# Altium schematic sheet Sheet2.SchDoc
size A4
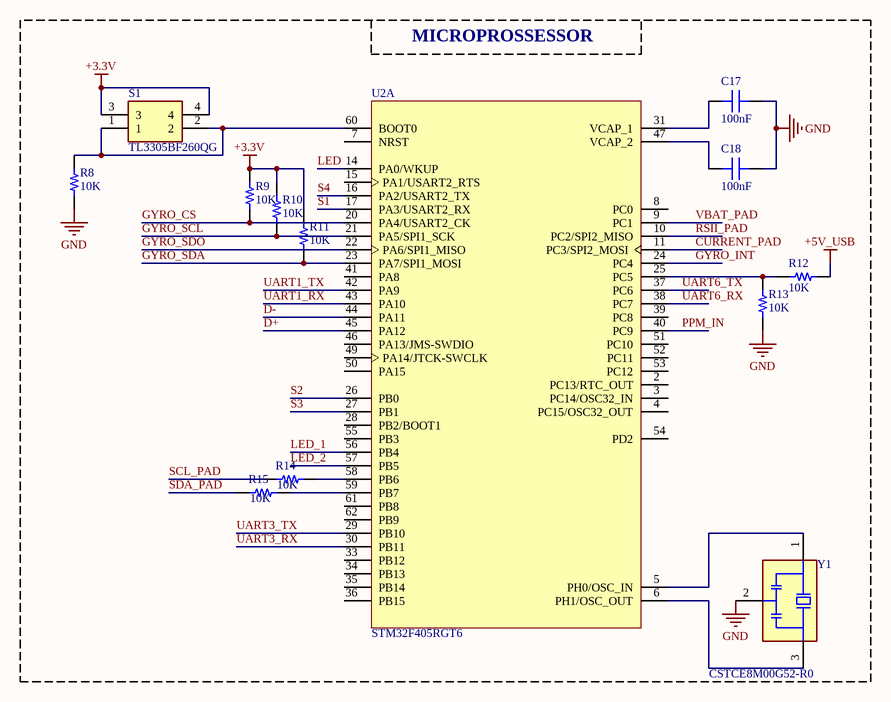
[diagram p0: Sheet2.SchDoc]

## Parts
C17  100nF  [CAP-0603]
C18  100nF  [CAP-0603]
R8  10K  [RES-0603]
R9  10K  [RES-0603]
R10  10K  [RES-0603]
R11  10K  [RES-0603]
R12  10K  [RES-0603]
R13  10K  [RES-0603]
R14  10K  [RES-0603]
R15  10K  [RES-0603]
S1  TL3305BF260QG  [TL3305BF260QG]
U2  STM32F405RGT6  [STMicroelectronics_LQFP64-5W_MFG]  (part A of 2)
Y1  CSTCE8M00G52-R0  [OSC_CSTCE8M00G52-R0]

## Blocks framed on the sheet
MICROPROSSESSOR: C17 C18 R8-R15 S1 U2 Y1

## Nets
+3.3V: R9.2 R10.2 R11.2 S1.3 S1.4
+5V_USB: R12.2
GND: C17.1 C18.1 R8.1 R13.1 Y1.2(GND)
CURRENT_PAD: U2.11(PC3/SPI2_MOSI)
D+: U2.45(PA12)
D-: U2.44(PA11)
GYRO_CS: R9.1 U2.20(PA4/USART2_CK)
GYRO_INT: U2.24(PC4)
GYRO_SCL: R10.1 U2.21(PA5/SPI1_SCK)
GYRO_SDA: R11.1 U2.23(PA7/SPI1_MOSI)
GYRO_SDO: U2.22(PA6/SPI1_MISO)
LED: U2.14(PA0/WKUP)
LED_1: U2.56(PB4)
LED_2: U2.57(PB5)
PPM_IN: U2.40(PC9)
RSII_PAD: U2.10(PC2/SPI2_MISO)
S1: U2.17(PA3/USART2_RX)
S2: U2.26(PB0)
S3: U2.27(PB1)
S4: U2.16(PA2/USART2_TX)
SCL_PAD: R14.1
SDA_PAD: R15.1
UART1_RX: U2.43(PA10)
UART1_TX: U2.42(PA9)
UART3_RX: U2.30(PB11)
UART3_TX: U2.29(PB10)
UART6_RX: U2.38(PC7)
UART6_TX: U2.37(PC6)
VBAT_PAD: U2.9(PC1)
NetC17_2: C17.2 U2.31(VCAP_1)
NetC18_2: C18.2 U2.47(VCAP_2)
NetR8_2: R8.2 S1.1 S1.2 U2.60(BOOT0)
NetR12_1: R12.1 R13.2 U2.25(PC5)
NetR14_2: R14.2 U2.58(PB6)
NetR15_2: R15.2 U2.59(PB7)
NetU2_5: U2.5(PH0/OSC_IN) Y1.1(IN)
NetU2_6: U2.6(PH1/OSC_OUT) Y1.3(OUT)

Not connected (* = marked no-connect by the designer): U2 2(PC13/RTC_OUT) 3(PC14/OSC32_IN) 4(PC15/OSC32_OUT) 7(NRST) 8(PC0) 15(PA1/USART2_RTS) 28(PB2/BOOT1) 33(PB12) 34(PB13) 35(PB14) 36(PB15) 39(PC8) 41(PA8) 46(PA13/JMS-SWDIO) 49(PA14/JTCK-SWCLK) 50(PA15) 51(PC10) 52(PC11) 53(PC12) 54(PD2) 55(PB3) 61(PB8) 62(PB9)

## Library data of the parts
C17 C18 = C0603C104K5RAC7411: Cap Ceramic 0.1uF 50V X7R 10% SMD 0603 125°C Paper T/R 100nF; Manufacturer: KEMET; Dissipation Factor: 2.5%; Supplier 1: Digi-Key; Manufacturer Part Number: C0603C104K5RAC7411; RoHS: Yes; Category: Ceramic Capacitors; Stock 1: 3300000; Pricing 1: 15000=0,01540, 30000=0,01463, 75000=0,01309, 105000=0,01059, 150000=0,01024, 375000=0,00963 (USD); Mount: Surface Mount; Case/Package: 0603; Case Code (Metric): 1608; Case Code (Imperial): 0603; Dielectric Material: Ceramic; Min Operating Temperature: -55°C; Max Operating Temperature: 125°C; Tolerance: 10%; Capacitance: 100nF; Dielectric: X7R; Voltage Rating (DC): 50V; Packaging: Tape and Reel; Package Quantity: 15000; Voltage Rating: 50V; Termination: SMD/SMT; Length: 1.6mm; Width: 0.031inch; Height: 0.8mm; Thickness: 0.035inch; Lead Pitch: 0.7mm; Depth: 0.8mm; Radiation Hardening: No; ComponentLink1URL: https://datasheet.ciiva.com/5424/kem-c1002-x7r-smd-5424426.pdf?src-supplier=Mouser; ComponentLink1Description: https://datasheet.ciiva.com/5424/kem-c1002-x7r-smd-5424426.pdf?src-supplier=Mouser; Supplier Part Number 1: 399-7374-2-ND
R8-R15 = RC0603FR-0710KL: 10 kOhms ±1% 0.1W, 1/10W Chip Resistor 0603 (1608 Metric) Moisture Resistant Thick Film; Manufacturer: Yageo; Resistance: 10kR; Temperature Coefficient: 100ppm/°C; Voltage Rating (DC): 50V; Power Rating: 100mW; Voltage Rating: 75V; Supplier 1: Digi-Key; Manufacturer Part Number: RC0603FR-0710KL; RoHS: Yes; Category: Chip SMD Resistors; Stock 1: 28996893; Pricing 1: 1=0,10000, 10=0,02400, 100=0,00970, 1000=0,00436, 2500=0,00378 (USD); Case/Package: 0603; Number of Pins: 2; Case Code (Imperial): 0603; Case Code (Metric): 1608; Weight: 7.1E-05oz; Size Code: 0603; Min Operating Temperature: -55°C; Max Operating Temperature: 155°C; Tolerance: 1%; Resistor Type: Thick Film; Packaging: Tape and Reel; Termination: SMD/SMT; Features: Moisture Resistant; Series: RC; Max Power Dissipation: 100mW; Number of Terminations: 2; Resistance Tolerance: 1%; Construction: Rectangular; Length: 1.6mm; Width: 0.8mm; Height: 0.45mm; Depth: 0.8mm; Lead Pitch: 0.3mm; REACH SVHC: Unknown; Lead Free: Lead Free; Military Standard: Not; RoHS Compliant: Yes; ComponentLink1URL: https://datasheet.ciiva.com/7660/38590-7660789.pdf?src-supplier=Element14; ComponentLink1Description: https://datasheet.ciiva.com/7660/38590-7660789.pdf?src-supplier=Element14; ComponentLink2URL: https://datasheet.ciiva.com/7983/443971-7983596.pdf?src-supplier=Element14; ComponentLink2Description: https://datasheet.ciiva.com/7983/443971-7983596.pdf?src-supplier=Element14; ComponentLink3URL: https://datasheet.ciiva.com/22747/443971-22747519.pdf?src-supplier=Element14; ComponentLink3Description: https://datasheet.ciiva.com/22747/443971-22747519.pdf?src-supplier=Element14; ComponentLink4URL: https://datasheet.ciiva.com/46440/1868787-46440891.pdf?src-supplier=Element14; ComponentLink4Description: https://datasheet.ciiva.com/46440/1868787-46440891.pdf?src-supplier=Element14; ComponentLink5URL: https://datasheet.ciiva.com/7746/1738695-7746239.pdf?src-supplier=Element14; ComponentLink5Description: https://datasheet.ciiva.com/7746/1738695-7746239.pdf?src-supplier=Element14; ComponentLink6URL: https://datasheet.ciiva.com/15189/getdatasheetpartid-409289-15189591.pdf?src-supplier=Verical; ComponentLink6Description: https://datasheet.ciiva.com/15189/getdatasheetpartid-409289-15189591.pdf?src-supplier=Verical; Supplier Part Number 1: 311-10.0KHRCT-ND
S1 = TL3305BF260QG: Switch; Manufacturer_Name: E-Switch; Datasheet Link: https://sten-eswitch-13110800-production.s3.amazonaws.com/system/asset/product_line/data_sheet/213/TL3305.pdf; Height: 5mm; Manufacturer_Part_Number: TL3305BF260QG; Mouser Part Number: 612-TL3305BF260QG; Mouser Price/Stock: https://www.mouser.co.uk/ProductDetail/E-Switch/TL3305BF260QG?qs=UrFqKgNWc7Tq35XCdypyiw%3D%3D
U2 = STM32F405RGT6: ARMÂ® CortexÂ®-M4 STM32F4 Microcontroller IC 32-Bit 168MHz 1MB _1M x 8_ FLASH 64-LQFP _10x10_; MF: STMicroelectronics; Package: LQFP-64 STMicroelectronics; Digi-Key_Purchase_URL: https://www.digikey.com/product-detail/en/stmicroelectronics/STM32F405RGT6/497-11767-ND/2754208?utm_source=snapeda&utm_medium=aggregator&utm_campaign=symbol; Value: *; MP: STM32F405RGT6; SnapEDA_Link: https://www.snapeda.com/parts/STM32F405RGT6/STMicroelectronics/view-part/105502/?ref=snap; Digi-Key_Part_Number: 497-11767-ND
Y1 = CSTCE8M00G52-R0: 8MHz Ceramic Resonator Built in Capacitor 10pF Â±0.2% -20Â°C ~ 80Â°C Surface Mount; MF: Murata; Price: None; Check_prices: https://www.snapeda.com/parts/CSTCE8M00G52-R0/Murata%20Electronics%20North%20America/view-part/234504/?ref=eda; SnapEDA_Link: https://www.snapeda.com/parts/CSTCE8M00G52-R0/Murata%20Electronics%20North%20America/view-part/234504/?ref=snap; Package: Surface Mount Murata Electronics North America; Availability: Bad; MP: CSTCE8M00G52-R0; Value: *